# Altium schematic sheet Channel_Power.SchDoc
size A4
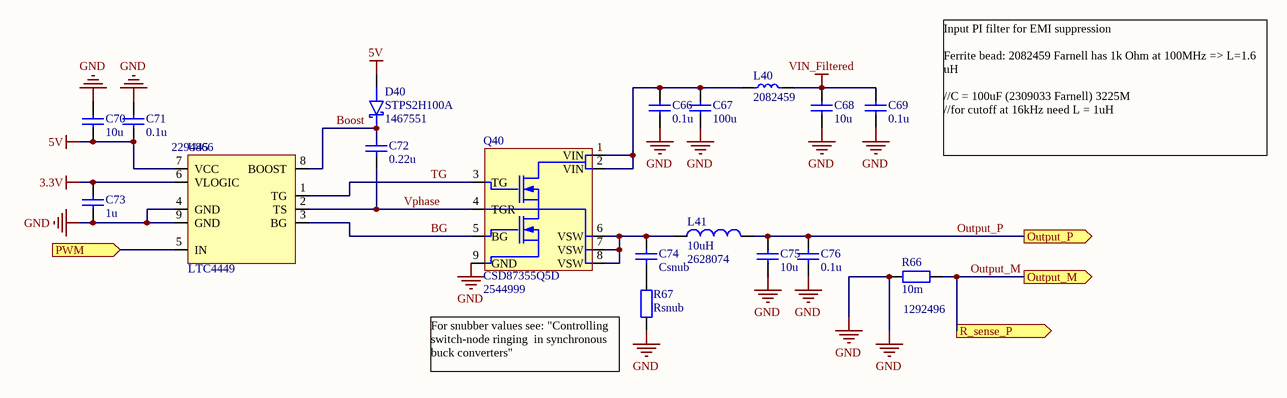
[diagram p0: Channel_Power.SchDoc]

## Parts
C66  0.1u  [CAPC1608M]
C67  100u  [CAPC3225M]
C68  10u  [CAPC2012M]
C69  0.1u  [CAPC1608M]
C70  10u  [CAPC2012M]
C71  0.1u  [CAPC1608M]
C72  0.22u  [CAPC1608M]
C73  1u  [CAPC1608M]
C74  Csnub  [CAPC1608M]
C75  10u  [CAPC2012M]
C76  0.1u  [CAPC1608M]
D40  STPS2H100A  Supplier Part Number 1: 1467551  [DSO-C2/X1.8]
L40  Supplier Part Number 1: 2082459  [WE_742792901]  (hidden comment: Wurth_742792901)
L41  10uH  Supplier Part Number 1: 2628074  [L_XAL1510]
Q40  CSD87355Q5D  Supplier Part Number 1: 2544999  [SON-8]
R66  10m  [RESC6432M]
R67  Rsnub  [RESC1608M]
U45  LTC4449  Supplier Part Number 1: 2294866  [DFN-8]

## Ports
Output_M (out), Output_P (out), PWM (in), R_sense_P (out)

## Nets
3.3V: C73.1 U45.6(VLOGIC)
5V: C70.2 C71.2 D40.A U45.7(VCC)
GND: C66.2 C67.2 C68.2 C69.2 C70.1 C71.1 C73.2 C75.2 C76.2 Q40.9(GND) R66.1 R67.1 U45.4(GND) U45.9(GND)
VIN_Filtered: C68.1 C69.1 L40.2
BG: Q40.5(BG) U45.3(BG)
Boost: C72.1 D40.C U45.8(BOOST)
Output_M: R66.2 ; port Output_M, port R_sense_P
Output_P: C75.1 C76.1 L41.1 ; port Output_P
PWM: U45.5(IN) ; port PWM
TG: Q40.3(TG) U45.1(TG)
Vphase: C72.2 Q40.4(TGR) U45.2(TS)
NetC66_1: C66.1 C67.1 L40.1 Q40.1(VIN) Q40.2(VIN)
NetC74_1: C74.1 L41.2 Q40.6(VSW) Q40.7(VSW) Q40.8(VSW)
NetC74_2: C74.2 R67.2

## Notes on the sheet
- Input PI filter for EMI suppression
  Ferrite bead: 2082459 Farnell has 1k Ohm at 100MHz => L=1.6 uH
  //C = 100uF (2309033 Farnell) 3225M
  //for cutoff at 16kHz need L = 1uH
- (near R66) 1292496
- (near R67) For snubber values see: "Controlling switch-node ringing  in synchronous buck converters"

## Library data of the parts
C66-C76 = C
  C66 C69 C71 C76: Value: 0.1u
  C67: Value: 100u
  C68 C70 C75: Value: 10u
  C72: Value: 0.22u
  C73: Value: 1u
  C74: Value: Csnub
D40 = STPS2H100A: Shottky rectifier; pin to pad: A>1 C>2; Supplier 1: Farnell
L40 = Wurth_742792901: Ferrite bead, 1.1k Ohm, 10A, (Wurth 742792901); Supplier 1: Farnell
L41 = L_XAL1510: XAL1510 Series inductor; Supplier 1: Farnell
Q40 = CSD87355Q5D: Synchronous Buck NexFET Power Block; Supplier 1: Farnell
R66 R67 = R
  R66: Value: 10m
  R67: Value: Rsnub
U45 = LTC4449: High Speed Synchronous N-Channel MOSFET Driver; Supplier 1: Farnell